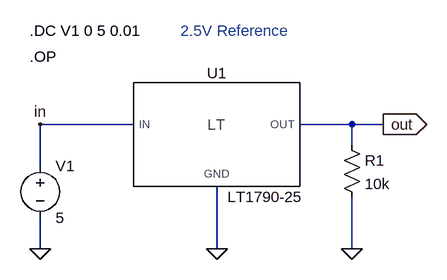
[diagram p0: schematic LT1790_25_test.asc]
LT1790_25_test.asc, the LTspice schematic file:
Version 4
SHEET 1 880 680
WIRE 0 256 0 304
WIRE 0 176 0 112
WIRE 0 112 144 112
WIRE 272 208 272 304
WIRE 400 112 480 112
WIRE 480 144 480 112
WIRE 480 112 528 112
WIRE 480 224 480 304
FLAG 0 304 0
FLAG 272 304 0
FLAG 528 112 out
IOPIN 528 112 Out
FLAG 480 304 0
FLAG 0 112 in
SYMBOL voltage 0 160 R0
WINDOW 123 0 0 Left 0
WINDOW 39 0 0 Left 0
SYMATTR InstName V1
SYMATTR Value 5
SYMBOL res 464 128 R0
SYMATTR InstName R1
SYMATTR Value 10k
SYMBOL PowerProducts\\LT1790-25 272 112 R0
SYMATTR InstName U1
TEXT -16 8 Left 0 !.OP
TEXT -16 -32 Left 0 !.DC V1 0 5 0.01
TEXT 216 -32 Left 0 ;2.5V Reference

The netlist it stands for:
* LT1790_25_test.asc
V1 in 0 5
R1 out 0 10k
XU1 in 0 out LT1790-25  ; pins IN GND OUT
.OP
.DC V1 0 5 0.01
* 2.5V Reference
.lib lt.lib
.backanno
.end